# EAGLE schematic DIN_extension (EAGLE 6.5.0)
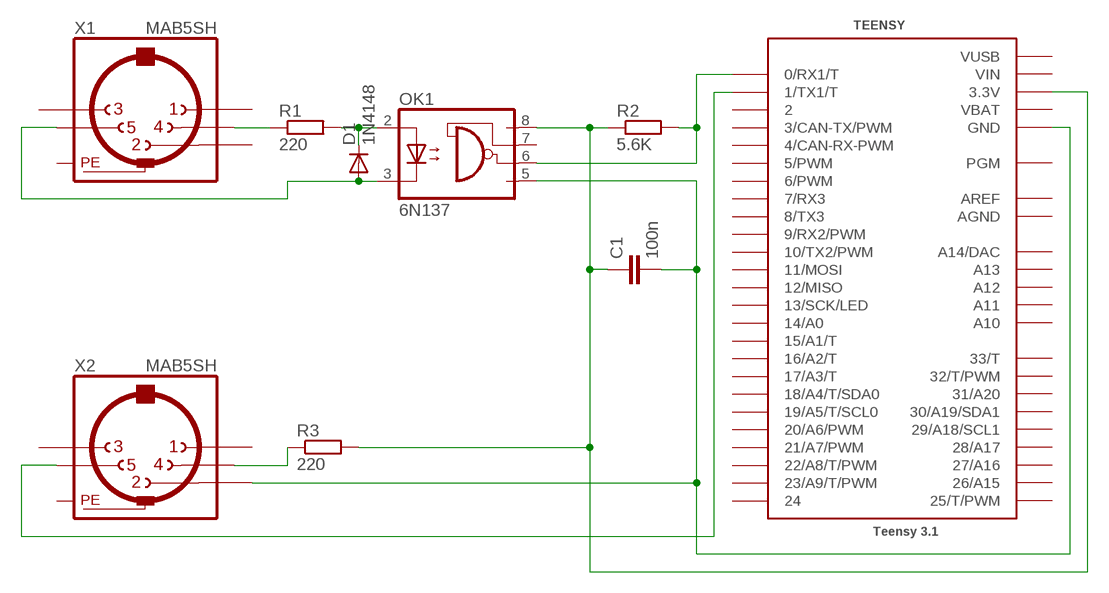
[diagram p0: schematic, sheet 1]

## Parts
C1  100n  C-EU025-024X044  [C025-024X044]
D1  1N4148  1N4148DO35-7  [DO35-7]
OK1  6N137  [DIL08]
R1  220  R-EU_0204/7  [0204/7]
R2  5.6K  R-EU_0204/7  [0204/7]
R3  220  R-EU_0204/7  [0204/7]
TEENSY  Teensy 3.1  TEENSY_3.1_ALL_PINS_AND_PADS  [TEENSY3_ALL_PINS_&_PADS]
X1  MAB5SH  [MAB5SH]
X2  MAB5SH  [MAB5SH]

## Nets
N$1: R1.1 X1.4
N$2: D1.C OK1.2(A) R1.2
N$3: C1.1 OK1.8(VCC) R2.1 R3.2 TEENSY.3.3V TEENSY.3.3V1(3.3V) TEENSY.3.3V2(3.3V)
N$5: TEENSY.1(1/TX1/T) X2.5
N$6: D1.A OK1.3(C) X1.5
N$7: C1.2 OK1.5(GND) TEENSY.GND TEENSY.GND1(GND) TEENSY.GND2(GND) X2.2
N$8: OK1.6(VO) R2.2 TEENSY.0(0/RX1/T)
N$9: R3.1 X2.4
Unconnected: OK1.7(VE) TEENSY.2 TEENSY.3(3/CAN-TX/PWM) TEENSY.4(4/CAN-RX-PWM) TEENSY.5(5/PWM) TEENSY.6(6/PWM) TEENSY.7(7/RX3) TEENSY.8(8/TX3) TEENSY.9(9/RX2/PWM) TEENSY.10(10/TX2/PWM) TEENSY.11(11/MOSI) TEENSY.12(12/MISO) TEENSY.13(13/SCK/LED) TEENSY.14/A0 TEENSY.15/A1(15/A1/T) TEENSY.16/A2(16/A2/T) TEENSY.17/A3(17/A3/T) TEENSY.18/A4(18/A4/T/SDA0) TEENSY.19/A5(19/A5/T/SCL0) TEENSY.20/A6(20/A6/PWM) TEENSY.21/A7(21/A7/PWM) TEENSY.22/A8(22/A8/T/PWM) TEENSY.23/A9(23/A9/T/PWM) TEENSY.24 TEENSY.25(25/T/PWM) TEENSY.26(26/A15) TEENSY.27(27/A16) TEENSY.28(28/A17) TEENSY.29(29/A18/SCL1) TEENSY.30(30/A19/SDA1) TEENSY.31(31/A20) TEENSY.32(32/T/PWM) TEENSY.33(33/T) TEENSY.A10 TEENSY.A11 TEENSY.A12 TEENSY.A13 TEENSY.PGM TEENSY.RESET/DAC(A14/DAC) X1.1 X1.2 X1.3 X2.1 X2.3

## Power pins joined to a net without a drawn wire
AGND: TEENSY.AGND
AREF: TEENSY.AREF
PE: X1.PE X1.PE@(PE) X2.PE X2.PE@(PE)
VBAT: TEENSY.VBAT
VIN: TEENSY.VIN
VUSB: TEENSY.VUSB

## Library data of the parts
C1 = resistor:C-EU: CAPACITOR, European symbol
D1 = diode:1N4148: DIODE high speed (Philips)
OK1 = optocoupler:6N137: MOTOROLA OPTO COUPLER; MPN: 6N137; OC_FARNELL: 1328376; OC_NEWARK: 52M1895
R1-R3 = rcl:R-EU_: RESISTOR, European symbol
TEENSY = Teensy_3_and_LC_Series_Boards_v1.1:TEENSY_3.1_ALL_PINS_AND_PADS: Footprint for Teensy 3.1 or 3.2 board using all pads and all through-holes. Pads need a 2x7 0.1" SMD header.
X1 X2 = con-hirschmann:MAB5SH: Female CONNECTOR 5 pins 90 deg. with shield, horizontal (DIN 41524); OC_FARNELL: 809883; OC_NEWARK: unknown